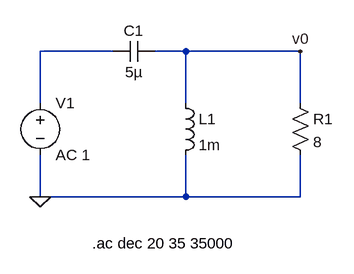
[diagram p0: schematic highpass.asc]
highpass.asc, the LTspice schematic file:
Version 4
SHEET 1 880 680
WIRE 160 32 48 32
WIRE 272 32 224 32
WIRE 448 32 272 32
WIRE 48 112 48 32
WIRE 272 112 272 32
WIRE 448 112 448 32
WIRE 48 256 48 192
WIRE 272 256 272 192
WIRE 272 256 48 256
WIRE 448 256 448 192
WIRE 448 256 272 256
FLAG 48 256 0
FLAG 448 32 v0
SYMBOL voltage 48 96 R0
WINDOW 123 0 0 Left 0
WINDOW 39 0 0 Left 0
SYMATTR InstName V1
SYMATTR Value AC 1
SYMBOL cap 224 16 R90
WINDOW 0 0 32 VBottom 2
WINDOW 3 32 32 VTop 2
SYMATTR InstName C1
SYMATTR Value 5µ
SYMBOL ind 256 96 R0
SYMATTR InstName L1
SYMATTR Value 1m
SYMBOL res 432 96 R0
SYMATTR InstName R1
SYMATTR Value 8
TEXT 128 328 Left 2 !.ac dec 20 35 35000

The netlist it stands for:
* highpass.asc
V1 N001 0 AC 1
C1 v0 N001 5µ
L1 v0 0 1m
R1 v0 0 8
.ac dec 20 35 35000
.backanno
.end

* Results of the author's LTspice run, read from the files saved beside the schematic
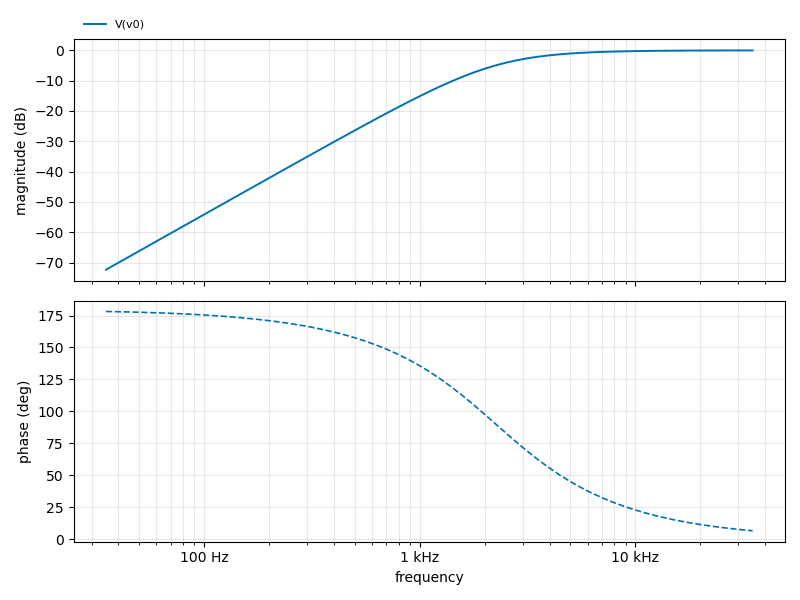
[diagram p1: AC Analysis of highpass.asc, plotted from the saved traces]
* AC Analysis, 1 run:
*   V(v0): -72.33 dB at 35 Hz, -0.02 dB at 35 kHz, peak -0.02 dB at 35 kHz, 3 dB below the peak at 2.941 kHz